# EAGLE design Ekoplazm (EAGLE 9.6.2)
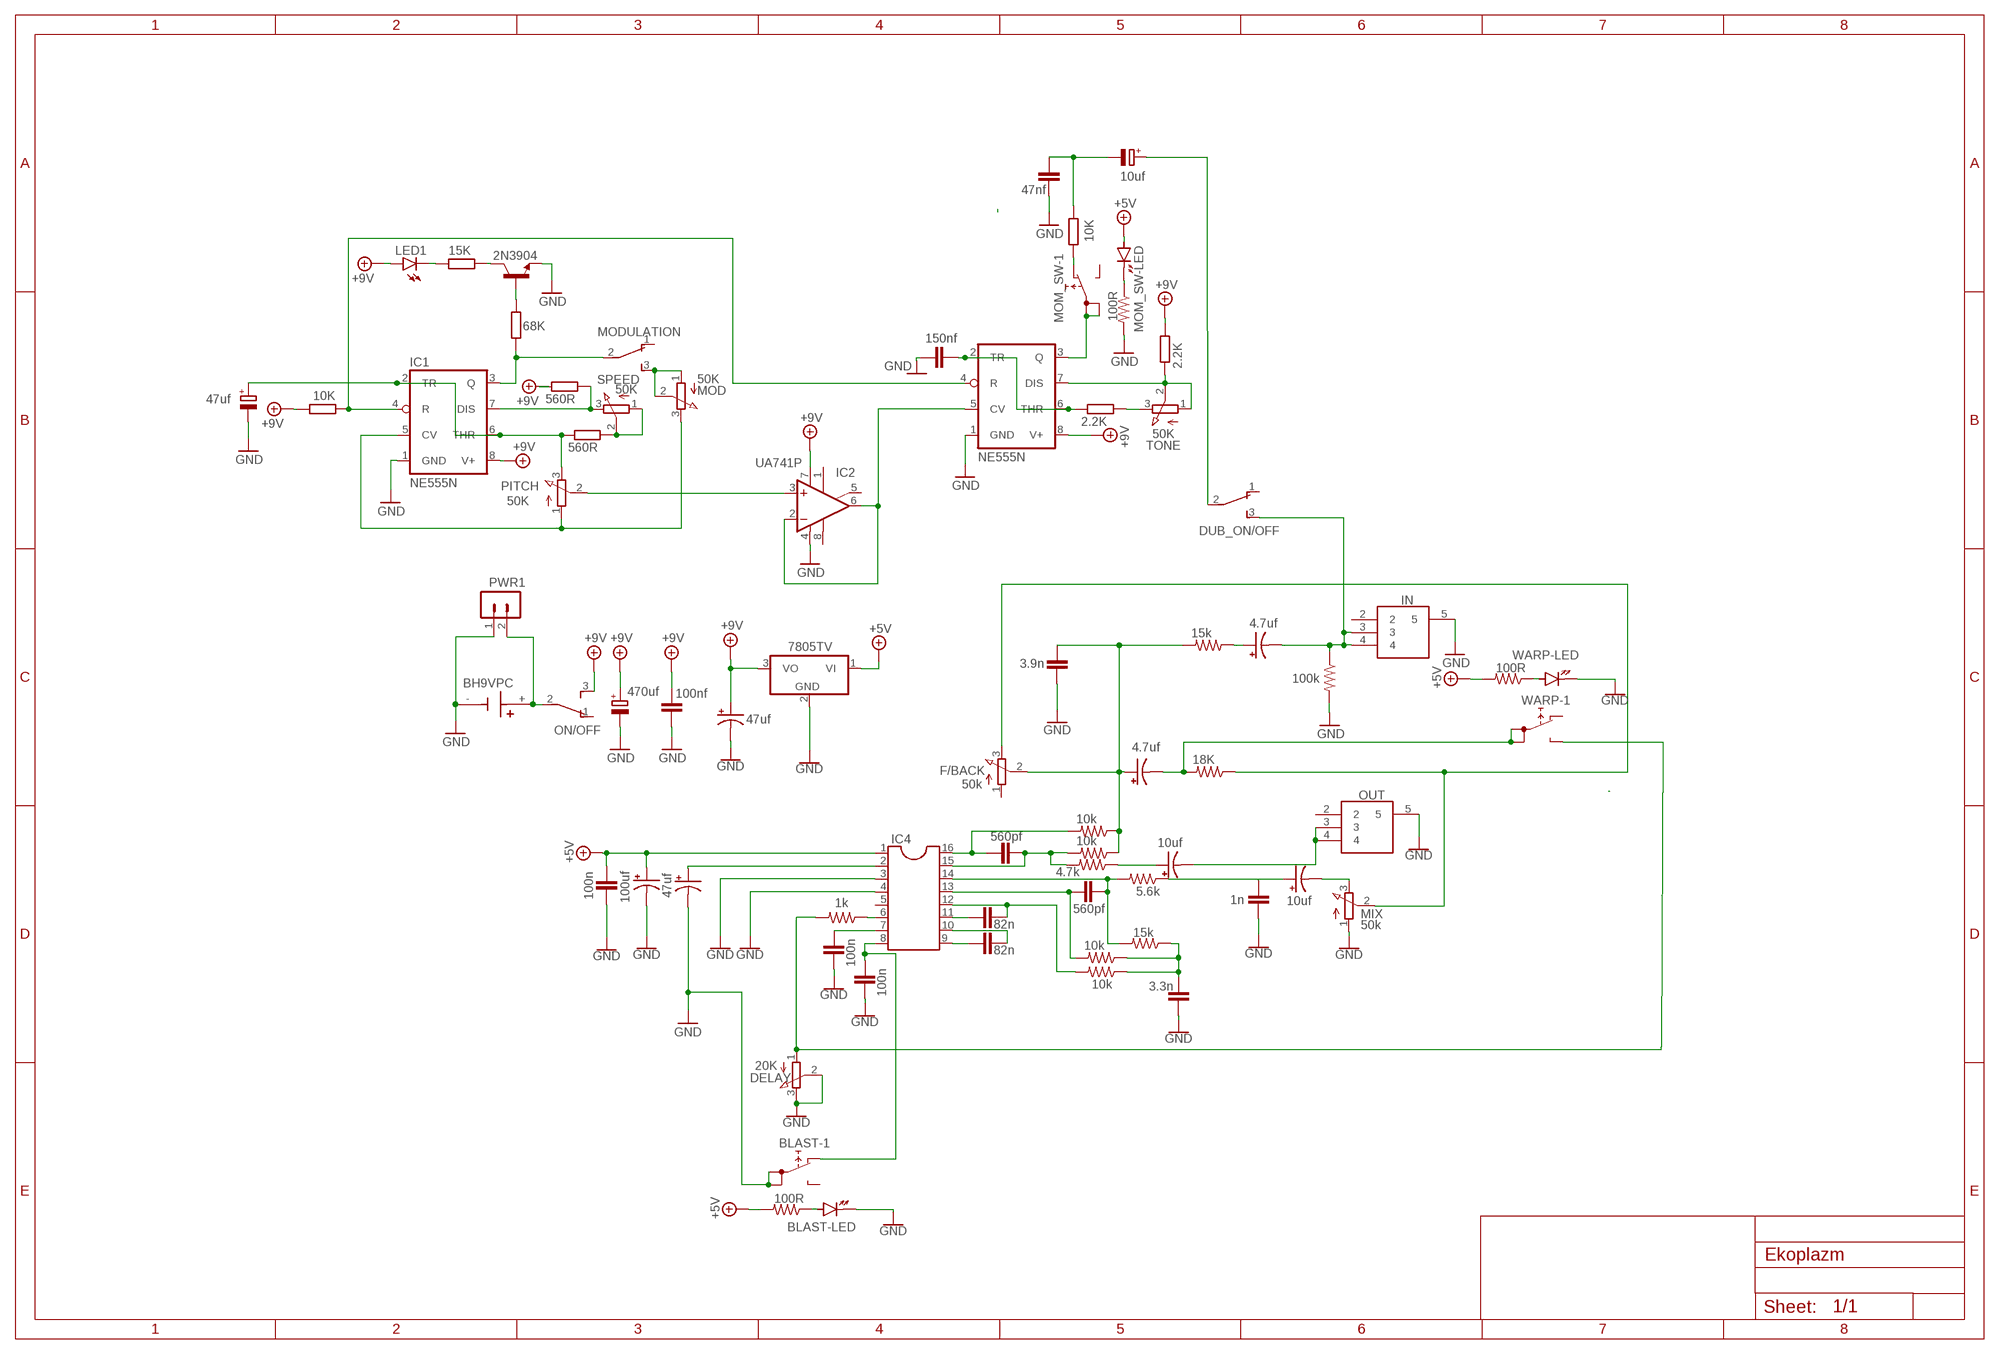
[diagram p0: schematic, sheet 1]

## Parts
10K  10K  R-EU_0207/10  [0207/10]
BLAST  5501-1LED  [5501-1LED]
BT1  BH9VPC  [BAT_BH9VPC]
C1  47uf  CPOL-EUE2-5  [E2-5]
C2  470uf  CPOL-EUE3.5-8  [E3,5-8]
C3  100nf  C-EU050-024X044  [C050-024X044]
C4  150nf  C-EU050-024X044  [C050-024X044]
C5  47nf  C-EU050-024X044  [C050-024X044]
C6  10uf  CPOL-EUE2-5  [E2-5]
C7  47uf  CPOL-USE2-5  [E2-5]
C8  1n  C-EU050-024X044  [C050-024X044]
C9  100n  C-EU050-024X044  [C050-024X044]
C10  100n  C-EU050-024X044  [C050-024X044]
C11  100n  C-EU050-024X044  [C050-024X044]
C12  82n  C-EU050-024X044  [C050-024X044]
C13  100uf  CPOL-USE2-5  [E2-5]
C14  47uf  CPOL-USE2-5  [E2-5]
C15  82n  C-EU050-024X044  [C050-024X044]
C16  560pf  C-EU050-024X044  [C050-024X044]
C17  560pf  C-EU050-024X044  [C050-024X044]
C18  10uf  CPOL-USE2-5  [E2-5]
C19  3.3n  C-EU050-024X044  [C050-024X044]
C20  10uf  CPOL-USE2-5  [E2-5]
C21  4.7uf  CPOL-USE2-5  [E2-5]
C22  3.9n  C-EU050-024X044  [C050-024X044]
C23  4.7uf  CPOL-USE2-5  [E2-5]
DELAY  20K  EVUF2L  [EVUFXL]
DUB_ON/OFF  TL36PO  [TL3XPO]
F/BACK  50k  EVUF2L  [EVUFXL]
IC1  NE555N  [DIL08]
IC2  UA741P  [DIL08]
IC3  NE555N  [DIL08]
IC4  DIL16  [DIL16]
IC5  7805TV  [TO220V]
IN  PJ-320A  [PJ320A]
LED1  LED3MM  [LED3MM]
MIX  50k  EVUF2L  [EVUFXL]
MOD  50K  EVUF2A  [EVUF]
MODULATION  TL36PO  [TL3XPO]
MOM_SW  5501-1LED  [5501-1LED]
ON/OFF  TL36PO  [TL3XPO]
OUT  PJ-320A  [PJ320A]
PITCH  50K  EVUF2A  [EVUF]
PWR1  B2B-PH-K-S  [B2B-PH-K-S]
R1  10K  R-EU_0207/10  [0207/10]
R2  560R  R-EU_0207/10  [0207/10]
R3  68K  R-EU_0207/10  [0207/10]
R4  15K  R-EU_0207/10  [0207/10]
R5  2.2K  R-EU_0207/10  [0207/10]
R6  2.2K  R-EU_0207/10  [0207/10]
R7  560R  R-EU_0207/10  [0207/10]
R8  10k  R-US_0207/10  [0207/10]
R10  5.6k  R-US_0207/10  [0207/10]
R11  1k  R-US_0207/10  [0207/10]
R12  10k  R-US_0207/10  [0207/10]
R13  15k  R-US_0207/10  [0207/10]
R14  100R  R-US_0207/10  [0207/10]
R15  10k  R-US_0207/10  [0207/10]
R16  4.7k  R-US_0207/10  [0207/10]
R17  10k  R-US_0207/10  [0207/10]
R18  18K  R-US_0207/10  [0207/10]
R19  15k  R-US_0207/10  [0207/10]
R20  100k  R-US_0207/10  [0207/10]
R21  100R  R-US_0207/10  [0207/10]
R22  100R  R-US_0207/10  [0207/10]
SPEED  50K  EVUF2A  [EVUF]
T1  2N3904  [TO92]
TONE  50K  EVUF2A  [EVUF]
WARP  5501-1LED  [5501-1LED]

## Nets
+5V: C9.1 C13.+ IC4.1 IC5.1(VI) MOM_SW.+(-LED:A) R14.2 R22.2
+9V: C2.+ C3.1 C14.+ IC1.8(V+) IC2.7(V+) IC3.8(V+) IC5.3(VO) LED1.A ON/OFF.3(S) R1.1 R6.2 R7.1
GND: BLAST.1A(-1:1A) BLAST.1B(-1:1B) BLAST.-(-LED:K) BT1.- C1.- C2.- C3.2 C4.1 C5.1 C7.- C8.2 C9.2 C10.2 C11.2 C13.- C14.- C19.1 C22.2 DELAY.2(S) DELAY.3(E) IC1.1(GND) IC2.4(V-) IC3.1(GND) IC4.3 IC4.4 IC5.2(GND) IN.5 MIX.1(A) OUT.5 PWR1.1 R20.2 R21.2 T1.3(E) WARP.-(-LED:K)
N$1: C1.+ IC1.2(TR) IC1.6(THR) PITCH.3(E) R2.1
N$2: R2.2 SPEED.1(A) SPEED.2(S)
N$3: IC1.7(DIS) R7.2 SPEED.3(E)
N$4: IC1.5(CV) MOD.3(E) PITCH.1(A)
N$5: IC1.4(R) IC3.4(R) R1.2
N$6: R3.2 T1.2(B)
N$7: R4.1 T1.1(C)
N$8: LED1.K(C) R4.2
N$9: IC1.3(Q) MODULATION.2(P) R3.1
N$10: MOD.1(A) MOD.2(S) MODULATION.3(S)
N$11: BT1.+ ON/OFF.2(P) PWR1.2
N$12: IC2.3(+IN) PITCH.2(S)
N$13: IC2.2(-IN) IC2.6(OUT) IC3.5(CV)
N$14: C4.2 IC3.2(TR) IC3.6(THR) R5.1
N$15: R5.2 TONE.3(E)
N$16: IC3.7(DIS) R6.1 TONE.1(A) TONE.2(S)
N$17: C7.+ IC4.2
N$18: 10K.2 C5.2 C6.-
N$19: C6.+ DUB_ON/OFF.2(P)
N$20: MOM_SW.-(-LED:K) R21.1
N$21: IC4.6 R11.1
N$22: C10.1 IC4.7
N$23: C12.1 IC4.9
N$24: C12.2 IC4.10
N$25: C15.1 IC4.11
N$26: C15.2 IC4.12 R8.2
N$27: C19.2 R8.1 R12.1 R13.1
N$28: C16.1 IC4.13 R12.2
N$29: C16.2 IC4.14 R10.2 R13.2
N$30: C8.1 C18.+ R10.1
N$31: C20.+ R16.1
N$32: C17.1 IC4.16 R17.2
N$33: C17.2 IC4.15 R15.2 R16.2
N$34: C21.+ C22.1 F/BACK.2(S) R15.1 R17.1 R19.2
N$35: C21.- R18.2 WARP.1A(-1:1A) WARP.1B(-1:1B)
N$36: F/BACK.3(E) MIX.2(S) R18.1
N$37: C23.+ R19.1
N$38: C23.- DUB_ON/OFF.3(S) IN.3 IN.4 R20.1
N$40: IC3.3(Q) MOM_SW.1A(-1:1A) MOM_SW.1B(-1:1B)
N$42: DELAY.1(A) R11.2 WARP.NO(-1:NO)
N$43: 10K.1 MOM_SW.NC(-1:NC)
N$44: BLAST.NC(-1:NC) C11.1 IC4.8
N$45: BLAST.+(-LED:A) R14.1
N$46: C20.- OUT.3 OUT.4
N$47: C18.- MIX.3(E)
N$50: R22.1 WARP.+(-LED:A)
Unconnected: BLAST.NO(-1:NO) DUB_ON/OFF.1(O) F/BACK.1(A) IC2.1(ON1) IC2.5(ON2) IC2.8(OPT) IC4.5 IN.2 MODULATION.1(O) MOM_SW.NO(-1:NO) ON/OFF.1(O) OUT.2 WARP.NC(-1:NC)

## Library data of the parts
10K R1-R7 = rcl:R-EU_: RESISTOR, European symbol; SPICEPREFIX: R
BLAST MOM_SW WARP = switch:55?-1LED: PUSHBUTTON SERIES 5500 SWITCHES 1 LED Source: www.e-switch.com .. 5500.pdf
BT1 = BH9VPC:BH9VPC: 9V Battery Holder Check prices <https://pricing.snapeda.com/parts/BH9VPC/MPD%20%28Memory%20Protection%20Devices%29/view-part?ref=eda>; AVAILABILITY: Warning; DESCRIPTION: BATTERY HOLDER 9V PC PIN; MF: MPD (Memory Protection Devices); MP: BH9VPC; PACKAGE: None; PRICE: None; PURCHASE-URL: https://pricing.snapeda.com/search/part/BH9VPC/?ref=eda
C1 C2 C6 = rcl:CPOL-EU: POLARIZED CAPACITOR, European symbol; SPICEPREFIX: C
C3-C5 C8-C12 C15-C17 C19 C22 = rcl:C-EU: CAPACITOR, European symbol; SPICEPREFIX: C
C7 C13 C14 C18 C20 C21 C23 = rcl:CPOL-US: POLARIZED CAPACITOR, American symbol; SPICEPREFIX: C
DELAY F/BACK MIX MOD PITCH SPEED TONE = pot:EVU: 9 mm Square Rotary Potentiometers Source: Panasonic
DUB_ON/OFF MODULATION ON/OFF = switch:TL36PO: TINY SWITCH ON - ON Source: http://www2.produktinfo.conrad.com/datenblaetter/700000-724999/705152-da-01-de-Subminiaturschalter_TL_36YO.pdf
IC1 IC3 = linear:*555: TIMER
IC2 = linear:*741: OP AMP
IC4 = ic-package:DIL16: Dual In Line / Socket
IC5 = linear:78*: Positive VOLTAGE REGULATOR Source: http://cache.national.com/ds/LM/LM78L05.pdf http://www.fairchildsemi.com/ds/LM/LM7805.pdf
IN OUT = PJ-320A:PJ-320A: 3.5 mm Audio Jack Connector PCB Mount Female Socket 4 Pin PJ-320A Source: Datasheet <http://www.helloxkb.com/public/images/pdf/PJ-320A-.pdf>; DESCRIPTION: 3.5 mm Audio Jack Connector PCB Mount Female Socket 4 Pin PJ-320A; HEIGHT: 5.3mm; MANUFACTURER_NAME: XKB Connectivity; MANUFACTURER_PART_NUMBER: PJ-320A
LED1 = led:LED: LED OSRAM: - CHIPLED LG R971, LG N971, LY N971, LG Q971, LY Q971, LO R971, LY R971 LH N974, LH R974 LS Q976, LO Q976, LY Q976 LO Q996 - Hyper CHIPLED LW Q18S LB Q993, LB Q99A, LB R99A - SideLED LS A670, LO A670, LY A670, LG A670, LP A670 LB A673, LV A673, LT A673, LW A673 LH A674 LY A675 LS A676, LA A676, LO A676, LY A676, LW A676 LS A679, LY A679, LG A679 - Hyper Micro SIDELED® LS Y876, LA Y876, LO Y876, LY Y876 LT Y87S - SmartLED LW L88C, LW L88S LB L89C, LB L89S, LG L890 LS L89K, LO L89K, LY L89K LS L896, LA L896, LO L896, LY L896 - TOPLED LS T670, LO T670, LY T670, LG T670, LP T670 LSG T670, LSP T670, LSY T670, LOP T670, LYG T670 LG T671, LOG T671, LSG T671 LB T673, LV T673, LT T673, LW T673 LH T674 LS T676, LA T676, LO T676, LY T676, LB T676, LH T676, LSB T676, LW T676 LB T67C, LV T67C, LT T67C, LS T67K, LO T67K, LY T67K, LW E67C LS E67B, LA E67B, LO E67B, LY E67B, LB E67C, LV E67C, LT E67C LW T67C LS T679, LY T679, LG T679 LS T770, LO T770, LY T770, LG T770, LP T770 LB T773, LV T773, LT T773, LW T773 LH T774 LS E675, LA E675, LY E675, LS T675 LS T776, LA T776, LO T776, LY T776, LB T776 LHGB T686 LT T68C, LB T68C - Hyper Mini TOPLED® LB M676 - Mini TOPLED Santana® LG M470 LS M47K, LO M47K, LY M47K Source: http://www.osram.convergy.de LUXEON: - LUMILED® LXK2-PW12-R00, LXK2-PW12-S00, LXK2-PW14-U00, LXK2-PW14-V00 LXK2-PM12-R00, LXK2-PM12-S00, LXK2-PM14-U00 LXK2-PE12-Q00, LXK2-PE12-R00, LXK2-PE12-S00, LXK2-PE14-T00, LXK2-PE14-U00 LXK2-PB12-K00, LXK2-PB12-L00, LXK2-PB12-M00, LXK2-PB14-N00, LXK2-PB14-P00, LXK2-PB14-Q00 LXK2-PR12-L00, LXK2-PR12-M00, LXK2-PR14-Q00, LXK2-PR14-R00 LXK2-PD12-Q00, LXK2-PD12-R00, LXK2-PD12-S00 LXK2-PH12-R00, LXK2-PH12-S00 LXK2-PL12-P00, LXK2-PL12-Q00, LXK2-PL12-R00 Source: www.luxeon.com KINGBRIGHT: KA-3528ASYC Source: www.kingbright.com
PWR1 = con-JST PH:B2B-PH: JST PH series header 2.00mm pitch disconnectable crimp style connectors, vertical (side entry type), 2 pins
R8 R10-R22 = rcl:R-US_: RESISTOR, American symbol; SPICEPREFIX: R
T1 = transistor:2N3904: NPN TRANSISTOR

## Board
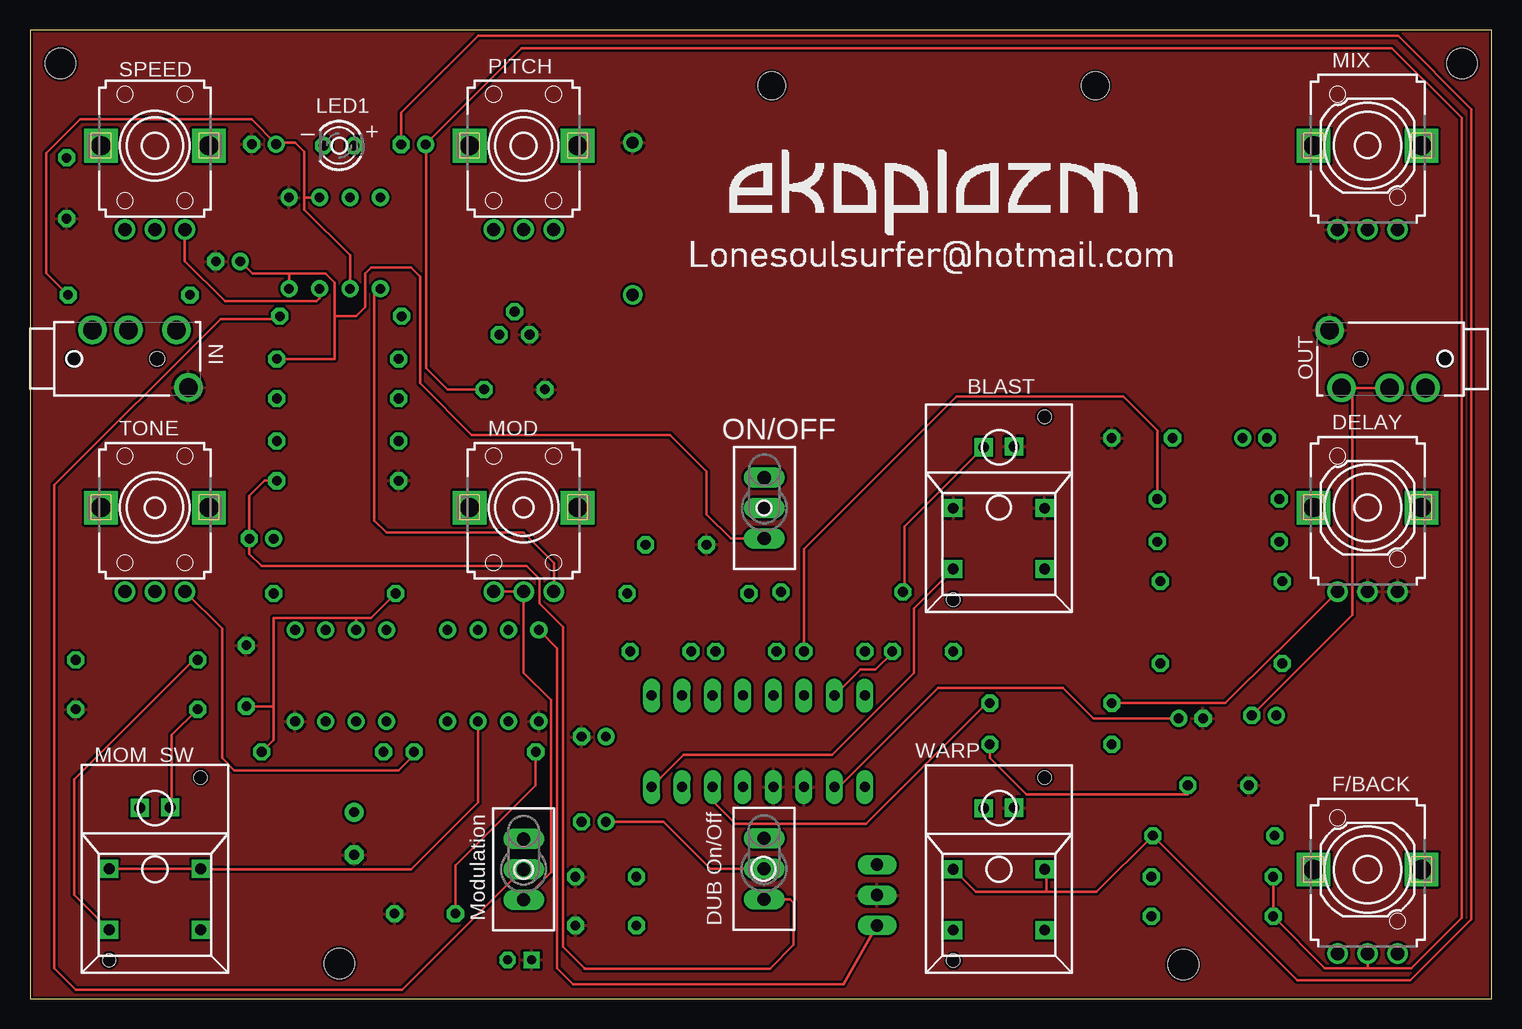
[diagram p1: board, top side]
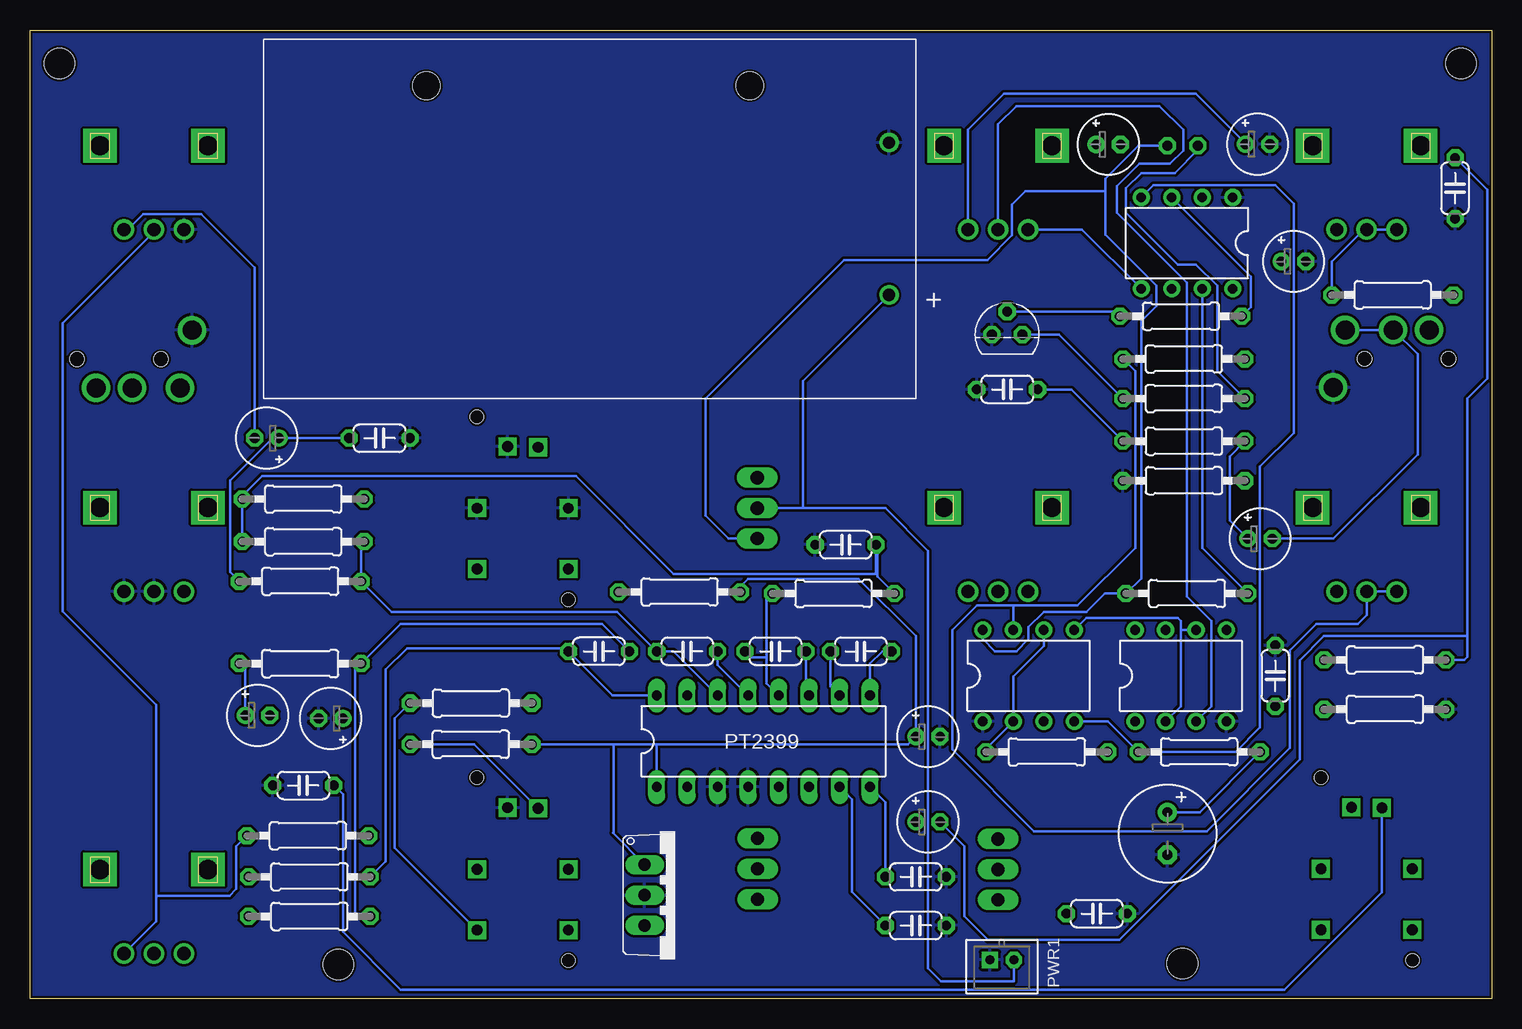
[diagram p2: board, bottom side, seen from below]

Size 121.84 x 80.76 mm. Coordinates in mm from the lower left corner, seen from the top.
Outline: 0,0 121.84,0 121.84,80.76 0,80.76 0,0
Copper layers (1*16): Top 0.035mm / dielectric 1.5mm / Bottom 0.035mm
Design rules "SparkFun": minimum track width 8mil, minimum drill 20mil, track to track 8mil, track to pad 8mil, pad to pad 8mil, via to via 8mil, smd to smd 8mil, copper to edge 8mil, drill to drill 8mil, minimum pad ring 12mil, minimum via ring 10mil, stop-mask expansion 4mil, vias tented up to drill 20mil, thermal gap 10mil
Holes 2.54 mm at 119.38,77.98 96.14,2.84 2.54,77.98 25.78,2.92

### Footprints (pad centres in the part's own frame; a part is rotated, then mirrored left to right if it is on the bottom)
0207/10 = drill 0.813 octagon: 1 -5.08,0; 2 5.08,0
5501-1LED = drill 0.9 pad 1.5 square: 1A 0,3.81; 1B 0,-3.81; + -5.08,-1.27; - -5.131,1.27; NC 5.08,-3.81; NO 5.08,3.81 | hole 1.1: -7.62,3.81; 7.62,-3.81
BAT_BH9VPC = drill 1.016: + 24.945,-6.35; - 24.945,6.35 | hole 2.29: -13.625,11.09; 13.345,11.09
E2-5 = drill 0.813 pad 1.27: + -1.016,0 | drill 0.813 pad 1.27 octagon: - 1.016,0
E3,5-8 = drill 0.813 pad 1.6: + -1.778,0 | drill 0.813 pad 1.6 octagon: - 1.778,0
C050-024X044 = drill 0.813 octagon: 1 -2.54,0; 2 2.54,0
EVUFXL = drill 1.1 pad 1.676: 1 -2.5,-7; 2 0,-7; 3 2.5,-7 | drill 1.6 pad 2.8 square: M1 4.5,0; M2 -4.5,0
TL3XPO = drill 1.1 pad 1.422 long: 1 -2.54,0; 2 0,0; 3 2.54,0
DIL08 = drill 0.813 pad 1.27: 1 -3.81,-3.81; 2 -1.27,-3.81; 3 1.27,-3.81; 4 3.81,-3.81; 5 3.81,3.81; 6 1.27,3.81; 7 -1.27,3.81; 8 -3.81,3.81
DIL16 = drill 0.813 long: 1 -8.89,-3.81; 2 -6.35,-3.81; 3 -3.81,-3.81; 4 -1.27,-3.81; 5 1.27,-3.81; 6 3.81,-3.81; 7 6.35,-3.81; 8 8.89,-3.81; 9 8.89,3.81; 10 6.35,3.81; 11 3.81,3.81; 12 1.27,3.81; 13 -1.27,3.81; 14 -3.81,3.81; 15 -6.35,3.81; 16 -8.89,3.81
TO220V = drill 1.016 long: 1 -2.54,-2.54; 2 0,-2.54; 3 2.54,-2.54
PJ320A = drill 1.58 pad 2.37: 2 0,0; 3 3,0; 4 7,0; 5 8,-4.8 | hole 1.2: -1.6,-2.4; 5.4,-2.4
LED3MM = drill 0.813 octagon: A -1.27,0; K 1.27,0
EVUF = drill 1.1 pad 1.676: 1 -2.5,-7; 2 0,-7; 3 2.5,-7 | drill 1.6 pad 2.8 square: M1 4.5,0; M2 -4.5,0
B2B-PH-K-S = drill 0.75 pad 1.3 square: 1 1,0 | drill 0.75 pad 1.3 octagon: 2 -1,0
TO92 = drill 0.813 octagon: 1 1.27,0; 2 0,1.905; 3 -1.27,0

### Placement (x,y rotation side)
10K  8.89,28.24 0 bottom
BLAST  80.77,40.89 270 top
BT1  75.18,65.02 0 bottom
C1  19.51,71.25 0 bottom
C2  27.03,13.77 270 bottom
C3  18.03,26.92 90 bottom
C4  32.92,7.09 180 bottom
C5  3.05,67.56 90 bottom
C6  46.99,14.73 0 bottom
C7  96.77,23.37 180 bottom
C8  92.71,46.74 0 bottom
C9  99.06,17.78 180 bottom
C10  48.01,6.1 0 bottom
C11  48.01,10.16 0 bottom
C12  52.58,28.96 180 bottom
C13  46.99,21.84 0 bottom
C14  16.51,61.47 0 bottom
C15  59.69,28.96 180 bottom
C16  67.06,28.96 180 bottom
C17  74.42,28.96 0 bottom
C18  102.11,46.74 180 bottom
C19  53.85,37.85 0 bottom
C20  102.87,23.62 0 bottom
C21  31.95,71.22 0 bottom
C22  40.39,50.8 180 bottom
C23  19.3,38.35 0 bottom
DELAY  111.51,40.94 0 top
DUB_ON/OFF  61.19,10.82 270 top
F/BACK  111.51,10.77 0 top
IC1  25.4,62.99 180 bottom
IC2  25.91,26.92 0 bottom
IC3  38.61,26.92 0 bottom
IC4  60.71,21.46 0 bottom
IC5  68.07,8.64 270 bottom
IN  5.21,55.75 0 top
LED1  25.76,71.12 180 top
MIX  111.51,71.12 0 top
MOD  41.15,40.94 0 top
MODULATION  41.15,10.77 270 top
MOM_SW  10.41,10.82 270 top
ON/OFF  61.21,40.89 270 top
OUT  116.33,50.93 180 top
PITCH  41.15,71.12 0 top
PWR1  40.82,3.23 180 bottom
R1  24.38,20.57 180 bottom
R2  8.25,58.67 180 bottom
R3  25.91,56.9 180 bottom
R4  25.65,50.04 0 bottom
R5  37.08,20.57 0 bottom
R6  25.65,53.34 0 bottom
R7  25.4,33.78 0 bottom
R8  54.86,33.78 180 bottom
R10  99.31,34.8 0 bottom
R11  85.09,24.64 180 bottom
R12  99.06,41.66 0 bottom
R13  99.06,38.1 0 bottom
R14  67.69,33.91 0 bottom
R15  98.55,6.86 0 bottom
R16  99.31,27.94 0 bottom
R17  98.55,10.16 0 bottom
R18  98.68,13.59 0 bottom
R19  25.65,46.48 180 bottom
R20  25.65,43.18 180 bottom
R21  8.89,24.13 0 bottom
R22  85.09,21.21 0 bottom
SPEED  10.41,71.12 0 top
T1  40.39,55.37 0 bottom
TONE  10.41,40.94 0 top
WARP  80.77,10.79 270 top

### Tracks (layer width: path | path; a pad name or v marks a point on that pad's centre or on a via)
+5V
  Top 0.203: R22.2 80.01,20.07 83.06,17.02 96.52,17.02 C9.1
  Bottom 0.203: C9.1 95.76,17.02 95.76,5.59 90.93,0.76 17.26,0.76 9.14,8.88 MOM_SW.+ | IC5.1 73.25,13.82 73.2,13.82 73.2,21.16 73.15,21.21 | R14.2 62.61,34.38 61.98,35.01 52.79,35.01 48.01,30.23 C13.+ 48.64,21.21 69.6,21.21 | R22.2 73.15,21.21 | 73.15,21.21 69.6,21.21 | IC4.1 69.6,21.21
+9V
  Top 0.203: 21.59,60.45 24.64,60.45 25.4,59.69 25.4,56.9 | 25.4,56.9 25.4,53.34 R6.2 | 27.18,31.75 20.32,31.75 20.32,24.38 | IC2.7 27.18,31.75 | 27.18,31.75 28.45,31.75 R7.1 | IC3.8 43.94,29.21 43.94,2.54 45.26,1.22 67.83,1.22 IC5.3 | 20.32,24.38 20.32,21.59 R1.1 | IC1.8 21.59,60.45 | 21.59,60.45 18.54,60.45 C14.+ | ON/OFF.3 58.42,38.35 56.39,40.39 56.39,43.94 53.34,46.99 36.83,46.99 32.51,51.31 32.51,60.2 31.75,60.96 28.45,60.96 27.94,60.45 27.94,57.66 27.18,56.9 25.4,56.9 | C3.1 20.32,24.38
  Bottom 0.203: IC3.8 42.42,29.97 41.4,28.96 39.62,28.96 38.61,29.97 38.61,30.99 37.34,32.26 33.78,32.26 32.26,33.78 R7.1 29.21,35.05 29.21,56.48 27.94,57.74 27.94,59.44 32.21,63.7 32.21,67.31 | R1.1 24.33,15.54 C2.+ | 32.21,67.31 32.21,68.38 29.46,71.12 LED1.A | 32.21,67.31 38.86,67.31 39.99,66.18 39.99,63.64 42.03,61.59 53.98,61.59 65.53,50.04 65.53,40.28 63.6,38.35 ON/OFF.3
GND
  pour Top: 0,80.77 121.92,80.77 121.92,0 0,0
  pour Bottom: 0,80.77 121.92,80.77 121.92,0 0,0
N$1
  Top 0.203: 22.86,66.8 22.86,65.79 26.67,61.98 IC1.6 | IC1.2 22.86,66.8 | R2.1 1.37,60.48 1.37,70.51 4.17,73.31 18.46,73.31 C1.+ 20.65,71.37 22.1,71.37 22.86,70.61 22.86,66.8
  Bottom 0.203: C1.+ 20.52,71.32 24.64,75.44 40.64,75.44 43.65,72.43 PITCH.3
N$2
  Bottom 0.203: R2.2 13.34,61.45 10.67,64.12 SPEED.2 SPEED.1
N$3
  Top 0.203: SPEED.3 12.91,61.51 16.26,58.17 23.88,58.17 24.13,58.42 IC1.7
  Bottom 0.203: R7.2 24.13,37.59 IC1.7
N$4
  Top 0.203: IC1.5 28.7,58.67 28.7,39.88 29.72,38.86 41.15,38.86 43.69,36.32 43.69,33.98 MOD.3
  Bottom 0.203: IC1.5 34.15,64.12 PITCH.1
N$5
  Bottom 0.203: IC1.4 28.19,67.82 18.03,67.82 16.51,66.29 16.51,47.16 19.3,44.36 19.3,22.61 21.34,20.57 R1.2 32,23.11 IC3.4
N$6
  Bottom 0.203: R3.2 31.37,57.28 T1.2
N$7
  Bottom 0.203: R4.1 36.07,55.37 T1.1
N$8
  Bottom 0.203: R4.2 22.86,52.32 22.86,59.44 24.64,61.21 26.16,61.21 30.48,65.53 30.48,67.56 29.21,68.83 26.42,68.83 24.49,70.76 LED1.K
N$9
  Top 0.203: MODULATION.2 41.05,10.77 31.04,0.76 3.79,0.76 2.02,2.54 2.02,42.81 15.88,56.67 20.6,56.67 R3.1
  Bottom 0.203: IC1.3 20.07,60.2 20.07,57.66 R3.1
N$10
  Top 0.203: MOD.1 MOD.2 41.15,27.18 43.43,24.89 43.43,10.52 MODULATION.3
N$11
  Bottom 0.203: 57.4,40.89 50.55,40.89 46.99,37.34 46.99,2.52 45.91,1.45 39.82,1.45 PWR1.2 | BT1.+ 57.4,51.51 57.4,40.89 | ON/OFF.2 57.4,40.89
N$12
  Bottom 0.203: IC2.3 23.37,24.38 23.37,31.5 25.4,33.53 25.4,59.69 31.24,65.53 31.24,67.73 29.38,69.6 26.82,69.6 25.7,70.71 25.7,72.44 27.69,74.42 39.62,74.42 41.15,72.9 PITCH.2
N$13
  Bottom 0.203: 25.91,30.73 25.91,24.38 IC2.2 | 25.91,30.73 IC2.6 | IC3.5 33.78,31.75 26.16,31.75 25.91,31.5 25.91,30.73
N$14
  Top 0.203: C4.2 35.48,7.11 35.48,11.1 42.16,17.78 R5.1
  Bottom 0.203: IC3.6 37.34,29.4 39.88,26.86 IC3.2 42.16,20.83 R5.1
N$15
  Top 0.203: TONE.3 16,30.86 16,20.07 17.02,19.05 30.73,19.05 32,20.32 R5.2
N$16
  Bottom 0.203: 39.88,32.77 42.93,32.77 44.96,30.73 44.96,20.78 38.15,13.97 23.75,13.97 16.82,20.89 16.82,29.02 14.6,31.24 11.18,31.24 10.41,32 TONE.2 TONE.1 | IC3.7 39.88,32.77 | R6.1 29.72,52.32 29.72,37.59 34.54,32.77 39.88,32.77
N$17
  Top 0.203: C7.+ 88.65,23.37 86.11,25.91 75.69,25.91 67.44,17.65 IC4.2
N$18
  Bottom 0.203: 2.03,30.23 13.97,30.23 15.98,28.22 15.98,19.96 31.04,4.9 41.99,4.9 43.94,6.86 43.94,12.7 C6.- | C5.2 0.38,67.44 0.38,51.69 2.03,50.04 2.03,30.23 | 10K.2 2.29,28.25 2.03,28.5 2.03,30.23
N$19
  Top 0.203: C6.+ 52.81,14.73 56.72,10.82 DUB_ON/OFF.2
N$20
  Top 0.203: MOM_SW.- 11.68,16.42 11.81,16.43 11.81,21.97 R21.1
N$21
  Top 0.203: R11.1 79.76,24.64 69.7,14.58 58.83,14.58 56.9,16.51 IC4.6
N$22
  Bottom 0.203: C10.1 53.34,8.89 53.34,16.64 IC4.7
N$23
  Bottom 0.203: C12.1 50.8,28.96 51.82,27.94 IC4.9
N$24
  Bottom 0.203: C12.2 55.12,26.04 IC4.10
N$25
  Bottom 0.203: C15.1 57.15,25.53 IC4.11
N$26
  Bottom 0.203: 60.45,28.45 60.45,26.29 IC4.12 | 60.45,28.45 60.45,33.27 R8.2 | C15.2 61.72,28.45 60.45,28.45
N$27
  Bottom 0.203: R8.1 51.18,35.18 51.18,37.72 C19.2 51.31,35.42 68.18,35.42 76.33,43.56 102.49,43.56 104.14,41.91 R12.1 R13.1
N$28
  Top 0.203: R12.2 93.98,47.37 91.16,50.19 77.22,50.19 64.52,37.49 C16.1
  Bottom 0.203: C16.1 64.52,27.81 IC4.13
N$29
  Bottom 0.203: R13.2 94.23,37.85 R10.2 91.69,32.26 72.9,32.26 C16.2 68.2,28.96 IC4.14
N$30
  Bottom 0.203: R10.1 105.16,35.56 105.16,43.18 101.6,46.74 101.35,46.74 C18.+ C8.1
N$31
  Bottom 0.203: R16.1 103.89,27.43 C20.+
N$32
  Bottom 0.203: IC4.16 73.28,25.27 C17.1 77.22,29.21 90.42,29.21 92.2,27.43 92.2,11.43 R17.2
N$33
  Top 0.203: IC4.15 69.22,27.43 70.48,27.43 71.88,28.83 C17.2
  Bottom 0.203: C17.2 74.17,31.24 90.93,31.24 R16.2 94.74,27.43 94.74,6.86 R15.2
N$34
  Top 0.203: 111.51,2.54 115.16,2.54 119.35,6.72 119.35,73.44 113.54,79.25 41,79.25 C21.+ 33.02,71.17 33.02,52.58 34.8,50.8 C22.1 | 111.51,2.54 107.95,2.54 R15.1 R17.1 | F/BACK.2 111.51,2.54
  Bottom 0.203: R19.2 35.05,50.8 C22.1
N$35
  Top 0.203: C21.- 30.94,73.86 37.34,80.26 114.05,80.26 120.14,74.17 120.14,6.6 115.06,1.52 105.66,1.52 R18.2 88.9,8.89 84.71,8.89 | 84.71,8.89 78.87,8.89 WARP.1B | WARP.1A 84.71,10.67 84.71,8.89
N$36
  Bottom 0.203: MIX.2 111.51,63.95 119.13,56.33 119.13,32.28 111.33,24.49 111.33,8.59 | 111.33,8.59 111.33,6.44 F/BACK.3 | R18.1 104.65,12.7 104.65,9.14 105.21,8.59 111.33,8.59
N$37
  Bottom 0.203: R19.1 21.84,45.21 21.84,39.88 C23.+
N$38
  Top 0.203: R20.1 19.56,43.18 18.29,41.91 C23.- 18.29,37.08 19.3,36.07 41.4,36.07 42.49,34.98 42.49,32.95 44.45,30.99 44.45,4.32 46.23,2.54 46.23,2.49 61.67,2.49 63.65,4.47 63.65,7.98 63.35,8.28 DUB_ON/OFF.3
  Bottom 0.203: IN.4 IN.3 6.17,53.72 6.17,45.39 13.21,38.35 C23.-
N$40
  Top 0.203: MOM_SW.1A 14.25,10.79 14.35,10.79 | 14.35,10.79 31.75,10.79 37.34,16.38 IC3.3 | MOM_SW.1B 14.33,10.82 14.35,10.79
N$42
  Top 0.203: DELAY.1 104.02,28.96 103.97,28.96 99.66,24.64 R11.2
  Bottom 0.203: R11.2 91.44,23.37 91.44,12.57 WARP.NO
N$43
  Top 0.203: MOM_SW.NC 3.68,8.66 3.68,18.29 13.64,28.25 10K.1
N$44
  Top 0.203: IC4.8 54.48,20.32 66.84,20.32 73.68,27.16 73.68,32.53 BLAST.NC
  Bottom 0.203: C11.1 50.55,16.38 IC4.8
N$45
  Top 0.203: R14.1 72.9,34.04 72.9,39.37 BLAST.+
N$46
  Top 0.203: OUT.3 110.24,50.93 | 110.24,50.93 OUT.4 | C20.- 110.24,32 110.24,50.93
N$47
  Bottom 0.203: C18.- 103.12,60.96 107.57,65.41 112.39,65.41 113.68,64.12 MIX.3
N$50
  Bottom 0.203: WARP.+ 84.84,21.21 R22.1

### Text on the board
tPlace: _ | + | Modulation | DUB On/Off
bPlace: PT2399